# Altium schematic sheet [2]- MCU .SchDoc
size A3; SheetNumber: 2; SheetTotal: 3
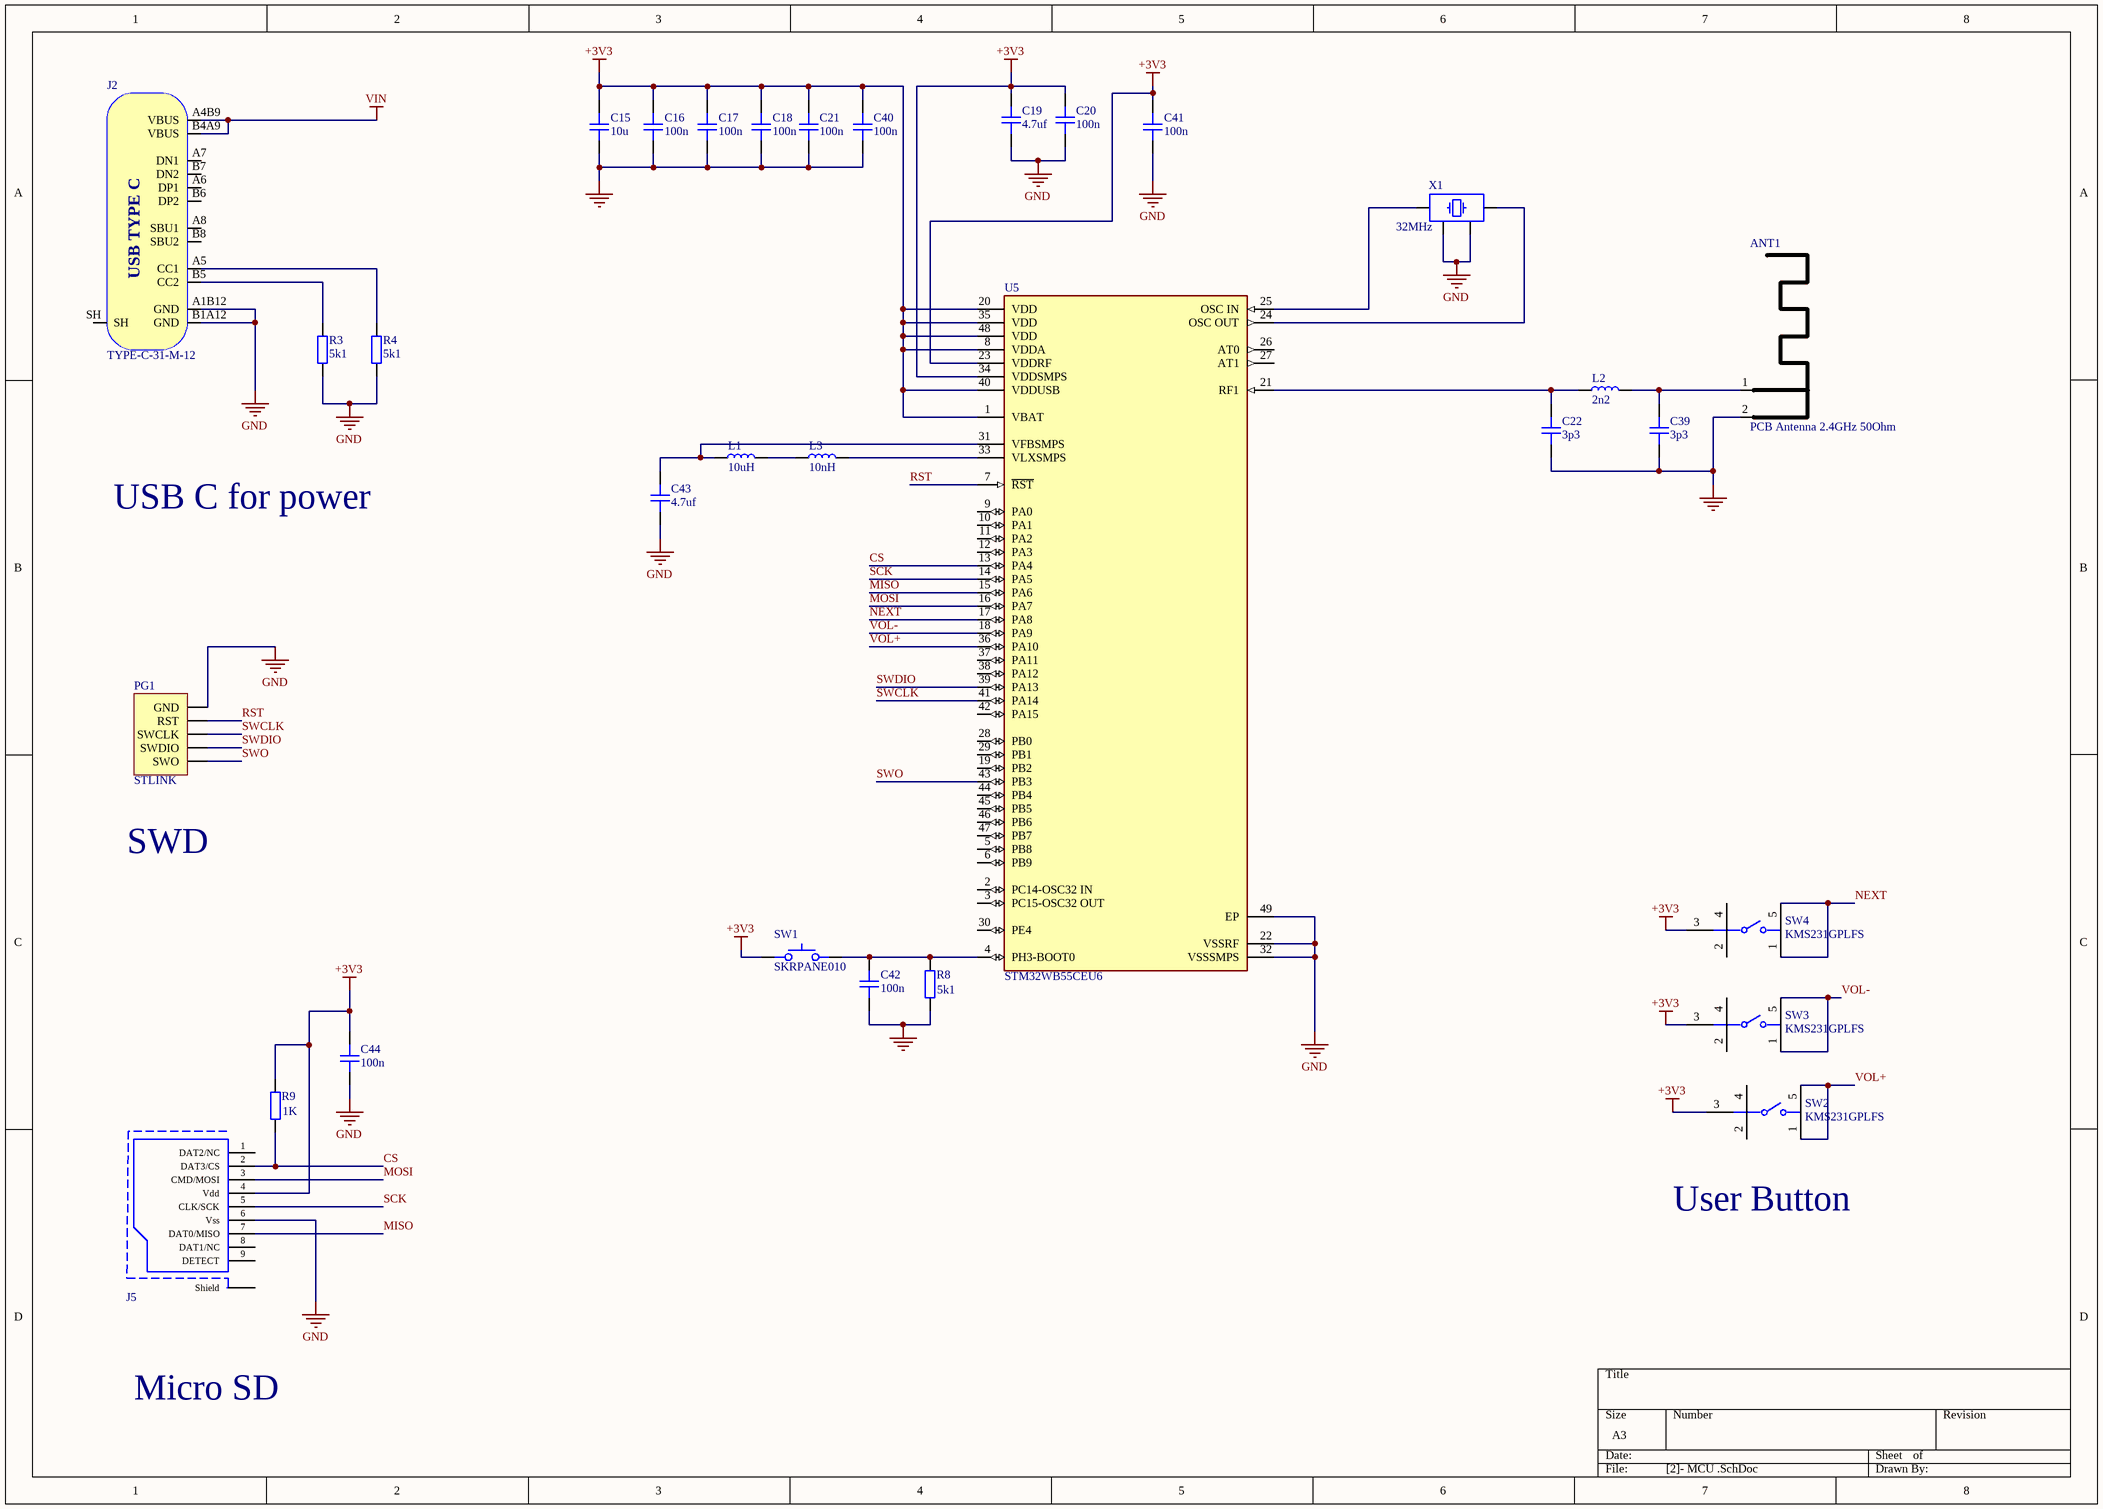
[diagram p0: [2]- MCU .SchDoc]

## Parts
ANT1  PCB Antenna 2.4GHz 50Ohm  [ANT_IFA_USB_2_4GHZ_50R]  (no BOM)
C15  10u  [CAP_0603]
C16  100n  [CAP_0402]
C17  100n  [CAP_0402]
C18  100n  [CAP_0402]
C19  4.7uf  [CAP_0402]
C20  100n  [CAP_0402]
C21  100n  [CAP_0402]
C22  3p3  [CAP_0402]
C39  3p3  [CAP_0402]
C40  100n  [CAP_0402]
C41  100n  [CAP_0402]
C42  100n  [CAP_0402]
C43  4.7uf  [CAP_0603]
C44  100n  [CAP_0402]
J2  TYPE-C-31-M-12  [TYPE-C-31-M-12]
J5  Micro SD  [TFP-09-2-12B]  (value not drawn)
L1  10uH  [IND_0402]
L2  2n2  [IND_0402]
L3  10nH  [IND_0402]
PG1  STLINK  [HDR_M_1X5]
R3  5k1  [RES_0402]
R4  5k1  [RES_0402]
R8  5k1  [RES_0402]
R9  1K  [RES_0402]
SW1  SKRPANE010  [SKRPANE010]
SW2  KMS231GPLFS  [FP-KMS231GPLFS-MFG]
SW3  KMS231GPLFS  [FP-KMS231GPLFS-MFG]
SW4  KMS231GPLFS  [FP-KMS231GPLFS-MFG]
U5  STM32WB55CEU6  [FP-UFQFPN48-A0B9-MFG]
X1  32MHz  [XTAL_2520]

## Nets
+3V3: C15.2 C16.2 C17.2 C18.2 C19.2 C20.2 C21.2 C40.2 C41.2 C44.2 J5.4(Vdd) R9.2 SW1.34 SW2.3 SW3.3 SW4.3 U5.1(VBAT) U5.8(VDDA) U5.20(VDD) U5.23(VDDRF) U5.34(VDDSMPS) U5.35(VDD) U5.40(VDDUSB) U5.48(VDD)
GND: ANT1.2(GND) C15.1 C16.1 C17.1 C18.1 C19.1 C20.1 C21.1 C22.1 C39.1 C40.1 C41.1 C42.1 C43.1 C44.1 J2.A1B12(GND) J2.B1A12(GND) J5.6(Vss) PG1.1(GND) R3.1 R4.1 R8.1 U5.22(VSSRF) U5.32(VSSSMPS) U5.49(EP) X1.2 X1.4
VIN: J2.A4B9(VBUS) J2.B4A9(VBUS)
CS: J5.2(DAT3/CS) R9.1 U5.13(PA4)
MISO: J5.7(DAT0/MISO) U5.15(PA6)
MOSI: J5.3(CMD/MOSI) U5.16(PA7)
NEXT: SW4.1 SW4.5 U5.17(PA8)
RST: PG1.2(RST) U5.7(~{RST})
SCK: J5.5(CLK/SCK) U5.14(PA5)
SWCLK: PG1.3(SWCLK) U5.41(PA14)
SWDIO: PG1.4(SWDIO) U5.39(PA13)
SWO: PG1.5(SWO) U5.43(PB3)
VOL+: SW2.1 SW2.5 U5.36(PA10)
VOL-: SW3.1 SW3.5 U5.18(PA9)
NetANT1_1: ANT1.1(RF) C39.2 L2.1
NetC22_2: C22.2 L2.2 U5.21(RF1)
NetC42_2: C42.2 R8.2 SW1.12 U5.4(PH3-BOOT0)
NetC43_2: C43.2 L1.2 U5.31(VFBSMPS)
NetJ2_A5: J2.A5(CC1) R4.2
NetJ2_B5: J2.B5(CC2) R3.2
NetL1_1: L1.1 L3.2
NetL3_1: L3.1 U5.33(VLXSMPS)
NetU5_24: U5.24(OSC_OUT) X1.3
NetU5_25: U5.25(OSC_IN) X1.1

Not connected (* = marked no-connect by the designer): J2 A6(DP1) A7(DN1) A8(SBU1) B6(DP2) B7(DN2) B8(SBU2) SH; J5 1(DAT2/NC) 8(DAT1/NC) 9(DETECT) 10(Shield); SW2 2 4; SW3 2 4; SW4 2 4; U5 2(PC14-OSC32_IN) 3(PC15-OSC32_OUT) 5(PB8) 6(PB9) 9(PA0) 10(PA1) 11(PA2) 12(PA3) 19(PB2) 26(AT0) 27(AT1) 28(PB0) 29(PB1) 30(PE4) 37(PA11) 38(PA12) 42(PA15) 44(PB4) 45(PB5) 46(PB6) 47(PB7)

## Notes on the sheet
- USB C for power
- SWD
- User Button
- Micro SD
- (in symbol TYPE-C-31-M-12) USB TYPE C

## Library data of the parts
ANT1 = ANT_IFA_USB_2_4GHZ_50R: Inverted F 2.4GHz ISM PCB Antenna 50 Ohm; ComponentLink1Description: Datasheet; ComponentLink1URL: https://www.ti.com/lit/an/swra117d/swra117d.pdf
C15 C43 = CAP_0603_10V: Capacitor SMD 0603 10V; Manufacturer: Samsung; Manufacturer Part Number: CL10A106KP8NNNC; LCSC: C19702
C16-C18 C20 C21 C40-C42 C44 = CAP_0402_50V: Capacitor SMD 0402 50V; Manufacturer: Samsung; Manufacturer Part Number: CL05B104KO5NNNC; LCSC: C1525
C19 C22 C39 = CAP_0402_50V: Capacitor SMD 0402 50V; Manufacturer: FH; Manufacturer Part Number: 0402CG3R3C500NT; LCSC: C1565
J2 = TYPE-C-31-M-12: USB Type C Connector Horizontal SMT; Manufacturer: Koren Hroparts; Manufacturer Part Number: TYPE-C-31-M-12; LCSC: C165948
J5 = Micro SD TFP-09-2-12B: PartNumber: TFP-09-2-12B
L1-L3 = IND_0402: Inductor SMD 0402; Manufacturer: Murata; Manufacturer Part Number: LQW15AN2N2G80D; LCSC: C412264
PG1 = STLINK Header P2.54mm (THD): PartNumber: Header 1X5 P2.54mm
R3 R4 R8 R9 = RES_0402: Resistor SMD 0402; Manufacturer: YAGEO; Manufacturer Part Number: RC0402JR-075K1L; LCSC: C105873
SW1 = SKRPANE010: Tactile Switch SMD SPST; Manufacturer: Alps Alpine; Manufacturer Part Number: SKRPANE010; LCSC: C470426
SW2-SW4 = CMP-10040-000026-1: SWITCH TACTILE SPST-NO 0.05A 50V; Contact Current Rating: 50mA; Max Voltage Rating (DC): 32V; Switch Travel: 0.3mm; Illumination Type: Illuminated; Power Rating: 1W; Operating Force: 3N; Switch Function: Off-Mom; Ratings: IP40; Actuator Length: 0.75mm; Mechanical Life: 100000Cycles; Throw Configuration: SPST; Min Operating Temperature: -40°C; Orientation: Right Angle; Radiation Hardening: No; Mount: Surface Mount; Max Current Rating: 50mA; Packaging: Tape and Reel; Width: 1.42mm; Depth: 4.6mm; Termination: Gull Wing; Contact Plating: Silver; Lead Free: Lead Free; Max Operating Temperature: 85°C; Length: 3.55mm; Current Rating: 50mA; Voltage Rating (DC): 32V; Package Quantity: 1; Contact Material: Silver
U5 = CMP-12160-000002-1: ULTRA-LOW-POWER DUAL CORE ARM CO; Manufacturer: STMicroelectronics; Max Junction Temp: +125°C; Data Rate: 2Mbits/s; Number Of Gpio: 30; Max Supply Voltage: 3.6V; Min Supply Voltage: 1.71V; Number Of Adc Channels: 13; Standoff Height: 0mm; Bandwidth: 2402-2480MHz; Max Frequency: 2480MHz; Interface: I2C,SPI,UART,USART,USB,Other; Max Power Dissipation: 392mW; Sensitivity: -100dBm; Temperature Range Low: -40°C; Digikey Description: ULTRA-LOW-POWER DUAL CORE ARM CO; Package: UFQFPN48-A0B9; ComponentLink2URL: https://www.st.com/resource/en/datasheet/stm32wb55rg.pdf; Ambient Temperature Range Low: -40°C; Automotive: No; Lead Free: Yes; RoHS: TRUE; Height: 0.65mm; Device Class L1: Integrated Circuits (ICs); Octopart: https://octopart.com/stm32wb55ceu6-stmicroelectronics-96611730; Device Class L2: RF Semiconductors and Devices; Ambient Temperature Range High: +105°C; Ipc Land Pattern Name: QFN50P700X700X57-48; Device Class L3: Transceivers; Category: IC; Temperature: -40°C to +125°C; ComponentLink2Description: Datasheet; Manufacturer Part Number: STM32WB55CEU6; Temperature Range High: +125°C
X1 = XTAL_2520: Crystal SMD 2520; Manufacturer: Seiko Epson; Manufacturer Number: Q24FA20H0020900; Frequency: 40MHz; LCSC: C255973